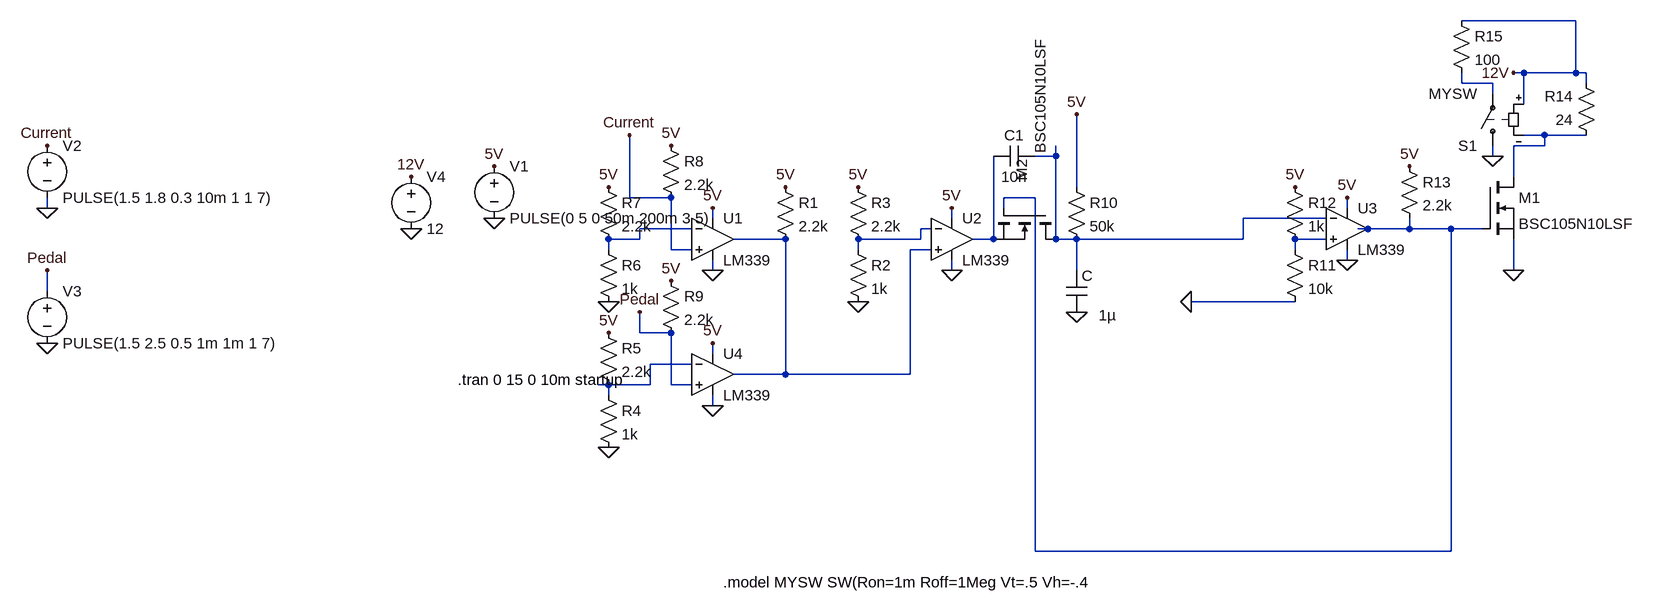
[diagram p0: schematic BSPD.asc]
BSPD.asc, the LTspice schematic file:
Version 4
SHEET 1 1480 680
WIRE 1136 -240 960 -240
WIRE 1056 -160 1040 -160
WIRE 1136 -160 1136 -240
WIRE 1136 -160 1056 -160
WIRE 1152 -160 1136 -160
WIRE 960 -144 960 -160
WIRE 1008 -144 960 -144
WIRE 1152 -144 1152 -160
WIRE 1008 -128 1008 -144
WIRE 1056 -112 1056 -160
WIRE 1088 -64 1056 -64
WIRE 1152 -64 1088 -64
WIRE 1088 -48 1088 -64
WIRE 1088 -48 1040 -48
WIRE 336 -32 336 -48
WIRE 336 -32 304 -32
WIRE 1008 -32 1008 -48
WIRE 1040 0 1040 -48
WIRE 368 16 368 -96
WIRE -320 32 -320 -64
WIRE -256 32 -320 32
WIRE 304 32 256 32
WIRE -1216 48 -1216 32
WIRE 256 48 256 32
WIRE 784 48 784 32
WIRE -192 64 -192 48
WIRE 176 64 176 48
WIRE 752 64 624 64
WIRE -224 80 -304 80
WIRE 144 80 128 80
WIRE 816 80 800 80
WIRE 880 80 880 64
WIRE 880 80 816 80
WIRE 944 80 880 80
WIRE 992 80 944 80
WIRE -304 96 -304 80
WIRE -304 96 -352 96
WIRE -80 96 -160 96
WIRE 128 96 128 80
WIRE 128 96 32 96
WIRE 240 96 240 -32
WIRE 240 96 208 96
WIRE 336 96 336 -32
WIRE 336 96 320 96
WIRE 368 96 336 96
WIRE 624 96 624 64
WIRE 624 96 368 96
WIRE 752 96 704 96
WIRE -352 112 -352 96
WIRE -256 112 -256 32
WIRE -224 112 -256 112
WIRE 32 112 32 96
WIRE 144 112 112 112
WIRE 704 112 704 96
WIRE 784 128 784 112
WIRE -192 144 -192 128
WIRE 176 144 176 128
WIRE 368 144 368 96
WIRE 1040 144 1040 96
WIRE -1216 176 -1216 144
WIRE 704 192 544 192
WIRE -304 240 -304 208
WIRE -256 240 -304 240
WIRE -192 272 -192 256
WIRE -224 288 -288 288
WIRE -80 304 -80 96
WIRE -80 304 -160 304
WIRE 112 304 112 112
WIRE 112 304 -80 304
WIRE -352 320 -368 320
WIRE -288 320 -288 288
WIRE -288 320 -352 320
WIRE -256 320 -256 240
WIRE -224 320 -256 320
WIRE -352 336 -352 320
WIRE -192 352 -192 336
WIRE 304 576 304 32
WIRE 944 576 944 80
WIRE 944 576 304 576
FLAG -528 64 0
FLAG -528 -16 5V
FLAG -192 48 5V
FLAG 176 48 5V
FLAG 784 32 5V
FLAG -192 256 5V
FLAG -192 144 0
FLAG 176 144 0
FLAG 784 128 0
FLAG -192 352 0
FLAG -80 16 5V
FLAG 32 192 0
FLAG 32 16 5V
FLAG -352 240 5V
FLAG -352 16 5V
FLAG -256 -48 5V
FLAG -256 160 5V
FLAG 368 -96 5V
FLAG 880 -16 5V
FLAG -1216 256 0
FLAG -1216 48 0
FLAG -1216 -48 Current
FLAG -320 -64 Current
FLAG -1216 144 Pedal
FLAG -304 208 Pedal
FLAG 1040 144 0
FLAG 1040 -160 12V
FLAG -656 0 12V
FLAG -656 80 0
FLAG 1008 -32 0
FLAG 544 192 0
FLAG 368 208 0
FLAG 704 16 5V
FLAG -352 416 0
FLAG -352 192 0
SYMBOL Comparators\\LM339 -192 32 R0
SYMATTR InstName U1
SYMBOL Comparators\\LM339 176 32 R0
SYMATTR InstName U2
SYMBOL Comparators\\LM339 784 16 R0
SYMATTR InstName U3
SYMBOL Comparators\\LM339 -192 240 R0
SYMATTR InstName U4
SYMBOL voltage -528 -32 R0
WINDOW 123 0 0 Left 2
WINDOW 39 0 0 Left 2
SYMATTR InstName V1
SYMATTR Value PULSE(0 5 0 50m 200m 3 5)
SYMBOL res -96 0 R0
SYMATTR InstName R1
SYMATTR Value 2.2k
SYMBOL res 16 96 R0
SYMATTR InstName R2
SYMATTR Value 1k
SYMBOL res 16 0 R0
SYMATTR InstName R3
SYMATTR Value 2.2k
SYMBOL res -368 320 R0
SYMATTR InstName R4
SYMATTR Value 1k
SYMBOL res -368 224 R0
SYMATTR InstName R5
SYMATTR Value 2.2k
SYMBOL res -368 96 R0
SYMATTR InstName R6
SYMATTR Value 1k
SYMBOL res -368 0 R0
SYMATTR InstName R7
SYMATTR Value 2.2k
SYMBOL res -272 -64 R0
SYMATTR InstName R8
SYMATTR Value 2.2k
SYMBOL res -272 144 R0
SYMATTR InstName R9
SYMATTR Value 2.2k
SYMBOL res 352 0 R0
SYMATTR InstName R10
SYMATTR Value 50k
SYMBOL cap 352 144 R0
WINDOW 3 50 69 Left 2
SYMATTR Value 1µ
SYMATTR InstName C
SYMBOL res 688 96 R0
SYMATTR InstName R11
SYMATTR Value 10k
SYMBOL res 688 0 R0
SYMATTR InstName R12
SYMATTR Value 1k
SYMBOL res 864 -32 R0
SYMATTR InstName R13
SYMATTR Value 2.2k
SYMBOL voltage -1216 -64 R0
WINDOW 123 0 0 Left 2
WINDOW 39 0 0 Left 2
SYMATTR InstName V2
SYMATTR Value PULSE(1.5 1.8 0.3 10m 1 1 7)
SYMBOL voltage -1216 160 R0
WINDOW 123 0 0 Left 2
WINDOW 39 0 0 Left 2
SYMATTR InstName V3
SYMATTR Value PULSE(1.5 2.5 0.5 1m 1m 1 7)
SYMBOL nmos 992 0 R0
SYMATTR InstName M1
SYMATTR Value BSC105N10LSF
SYMBOL res 1168 -48 R180
WINDOW 0 36 76 Left 2
WINDOW 3 36 40 Left 2
SYMATTR InstName R14
SYMATTR Value 24
SYMBOL voltage -656 -16 R0
WINDOW 123 0 0 Left 2
WINDOW 39 0 0 Left 2
SYMATTR InstName V4
SYMATTR Value 12
SYMBOL sw 1008 -32 R180
SYMATTR InstName S1
SYMATTR Value MYSW
SYMBOL res 944 -256 R0
SYMATTR InstName R15
SYMATTR Value 100
SYMBOL nmos 336 48 R90
WINDOW 0 -75 52 Left 2
WINDOW 3 -262 24 Left 2
SYMATTR InstName M2
SYMATTR Value BSC105N10LSF
SYMBOL cap 304 -48 R90
WINDOW 0 0 32 VBottom 2
WINDOW 3 32 32 VTop 2
SYMATTR InstName C1
SYMATTR Value 10n
TEXT -584 312 Left 2 !.tran 0 15 0 10m startup
TEXT -176 624 Left 2 !.model MYSW SW(Ron=1m Roff=1Meg Vt=.5 Vh=-.4

The netlist it stands for:
* BSPD.asc
XU1 Current N005 5V 0 N007 LM339  ; pins In+ In- V+ V- OUT
XU2 N007 N006 5V 0 N008 LM339  ; pins In+ In- V+ V- OUT
XU3 N009 N003 5V 0 N004 LM339  ; pins In+ In- V+ V- OUT
XU4 Pedal N010 5V 0 N007 LM339  ; pins In+ In- V+ V- OUT
V1 5V 0 PULSE(0 5 0 50m 200m 3 5)
R1 5V N007 2.2k
R2 N006 0 1k
R3 5V N006 2.2k
R4 N010 0 1k
R5 5V N010 2.2k
R6 N005 0 1k
R7 5V N005 2.2k
R8 5V Current 2.2k
R9 5V Pedal 2.2k
R10 5V N003 50k
C N003 0 1µ
R11 N009 0 10k
R12 5V N009 1k
R13 5V N004 2.2k
V2 Current 0 PULSE(1.5 1.8 0.3 10m 1 1 7)
V3 Pedal 0 PULSE(1.5 2.5 0.5 1m 1m 1 7)
M1 N002 N004 0 0 BSC105N10LSF
R14 N002 12V 24
V4 12V 0 12
S1 0 N001 12V N002 MYSW
R15 12V N001 100
M2 N003 N004 N008 N008 BSC105N10LSF
C1 N003 N008 10n
.model NMOS NMOS
.model PMOS PMOS
.lib standard.mos
.tran 0 15 0 10m startup
.model MYSW SW(Ron=1m Roff=1Meg Vt=.5 Vh=-.4
.lib LM339.sub
.backanno
.end